# EAGLE design i2c-multiplexer-v2 (EAGLE 6.4)
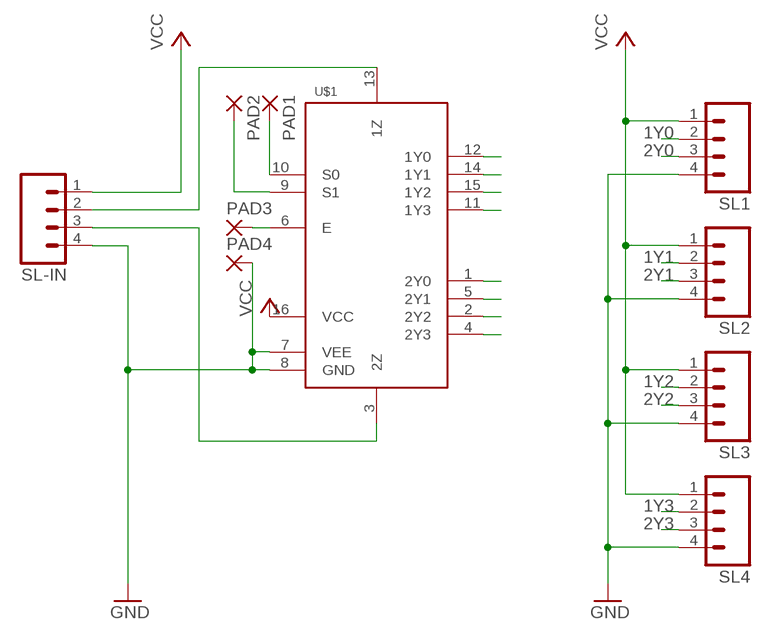
[diagram p0: schematic, sheet 1]

## Parts
PAD1  1,6/0,8  [1,6/0,8]
PAD2  1,6/0,8  [1,6/0,8]
PAD3  1,6/0,8  [1,6/0,8]
PAD4  1,6/0,8  [1,6/0,8]
SL1  M04  [04P]
SL2  M04  [04P]
SL3  M04  [04P]
SL4  M04  [04P]
SL-IN  M04  [04P]
U$1  74HC4052SO-16  [SO16]

## Nets
1Y0: SL1.2 U$1.12(1Y0)
1Y1: SL2.2 U$1.14(1Y1)
1Y2: SL3.2 U$1.15(1Y2)
1Y3: SL4.2 U$1.11(1Y3)
2Y0: SL1.3 U$1.1(2Y0)
2Y1: SL2.3 U$1.5(2Y1)
2Y2: SL3.3 U$1.2(2Y2)
2Y3: SL4.3 U$1.4(2Y3)
GND: PAD4.1(P) SL1.4 SL2.4 SL3.4 SL4.4 SL-IN.4 U$1.7(VEE) U$1.8(GND)
N$1: SL-IN.2 U$1.13(1Z)
N$2: SL-IN.3 U$1.3(2Z)
N$3: PAD3.1(P) U$1.6(E)
N$4: PAD2.1(P) U$1.9(S1)
N$5: PAD1.1(P) U$1.10(S0)
VCC: SL1.1 SL2.1 SL3.1 SL4.1 SL-IN.1 U$1.16(VCC)

## Library data of the parts
PAD1-PAD4 = wirepad:1,6/0,8: THROUGH-HOLE PAD
SL1-SL4 SL-IN = con-amp-quick:M04: AMP QUICK CONNECTOR; OC_FARNELL: unknown; OC_NEWARK: unknown
U$1 = serge:74HC4052

## Board
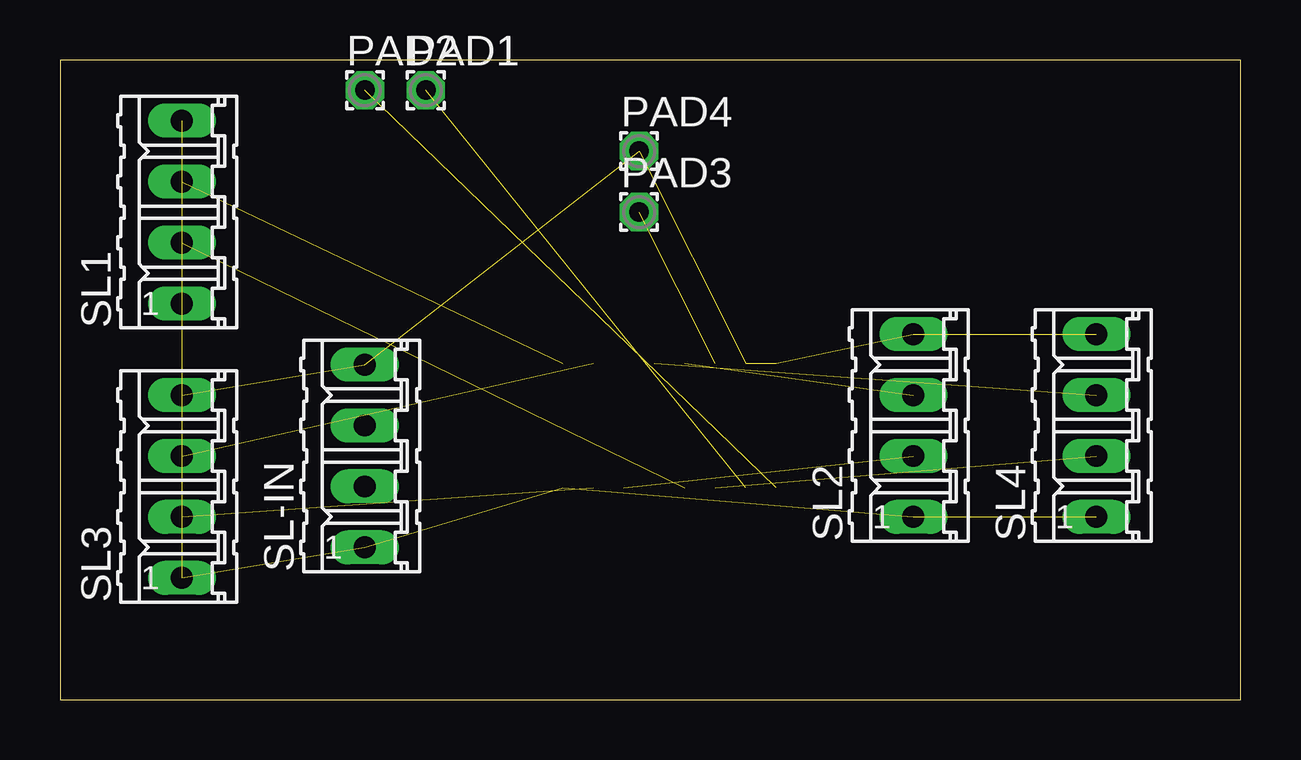
[diagram p1: board, top side]
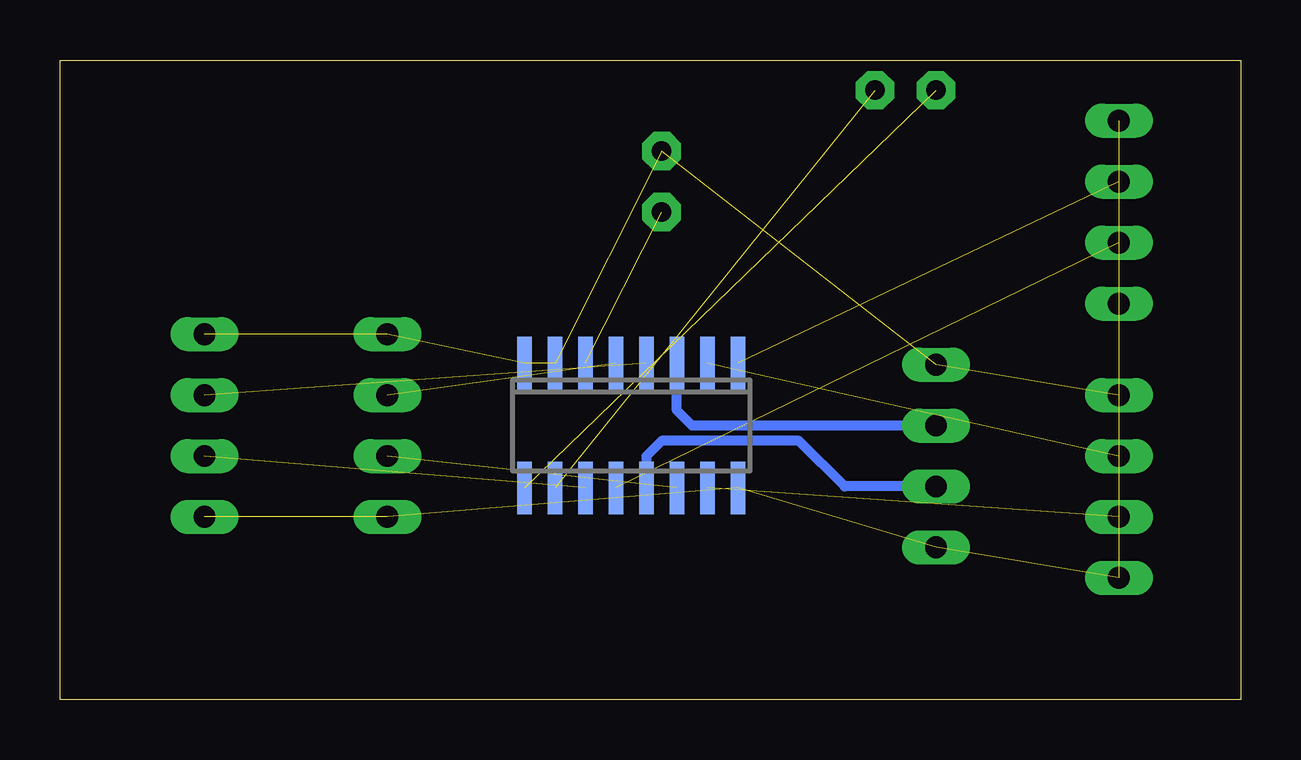
[diagram p2: board, bottom side, seen from below]

Size 49.2 x 26.66 mm. Coordinates in mm from the lower left corner, seen from the top.
Outline: 0,0 49.2,0 49.2,26.66 0,26.66 0,0
Copper layers (1*16): Top 0.035mm / dielectric 1.5mm / Bottom 0.035mm
Design rules "default": minimum track width 10mil, minimum drill 24mil, track to track 16mil, track to pad 16mil, pad to pad 16mil, via to via 16mil, smd to smd 16mil, copper to edge 16mil, drill to drill 8mil, minimum pad ring 10mil, minimum via ring 8mil, stop-mask expansion 4mil, vias tented up to drill 0mil, thermal gap 10mil

### Footprints (pad centres in the part's own frame; a part is rotated, then mirrored left to right if it is on the bottom)
1,6/0,8 = drill 0.813 pad 1.6 octagon: 1 0,0
04P = drill 0.914 long: 1 -3.81,0; 2 -1.27,0; 3 1.27,0; 4 3.81,0
SO16 = smd 0.6 x 2.2: 1 -4.445,-2.6; 2 -3.175,-2.6; 3 -1.905,-2.6; 4 -0.635,-2.6; 5 0.635,-2.6; 6 1.905,-2.6; 7 3.175,-2.6; 8 4.445,-2.6; 9 4.445,2.6; 10 3.175,2.6; 11 1.905,2.6; 12 0.635,2.6; 13 -0.635,2.6; 14 -1.905,2.6; 15 -3.175,2.6; 16 -4.445,2.6

### Placement (x,y rotation side)
PAD1  15.24,25.4 0 top
PAD2  12.7,25.4 0 top
PAD3  24.13,20.32 0 top
PAD4  24.13,22.86 0 top
SL1  5.08,20.32 90 top
SL2  35.56,11.43 90 top
SL3  5.08,8.89 90 top
SL4  43.18,11.43 90 top
SL-IN  12.7,10.16 90 top
U$1  25.4,11.43 180 bottom

### Tracks (layer width: path | path; a pad name or v marks a point on that pad's centre or on a via)
1Y0  (1 unrouted)
1Y1  (1 unrouted)
1Y2  (1 unrouted)
1Y3  (1 unrouted)
2Y0  (1 unrouted)
2Y1  (1 unrouted)
2Y2  (1 unrouted)
2Y3  (1 unrouted)
GND  (7 unrouted)
N$1
  Bottom 0.406: SL-IN.2 16.51,8.89 18.41,10.79 24.13,10.79 24.77,10.16 U$1.13
N$2
  Bottom 0.406: SL-IN.3 22.86,11.43 23.5,12.06 U$1.3
N$3  (1 unrouted)
N$4  (1 unrouted)
N$5  (1 unrouted)
VCC  (5 unrouted)